# EAGLE design gateway (EAGLE 6.4)
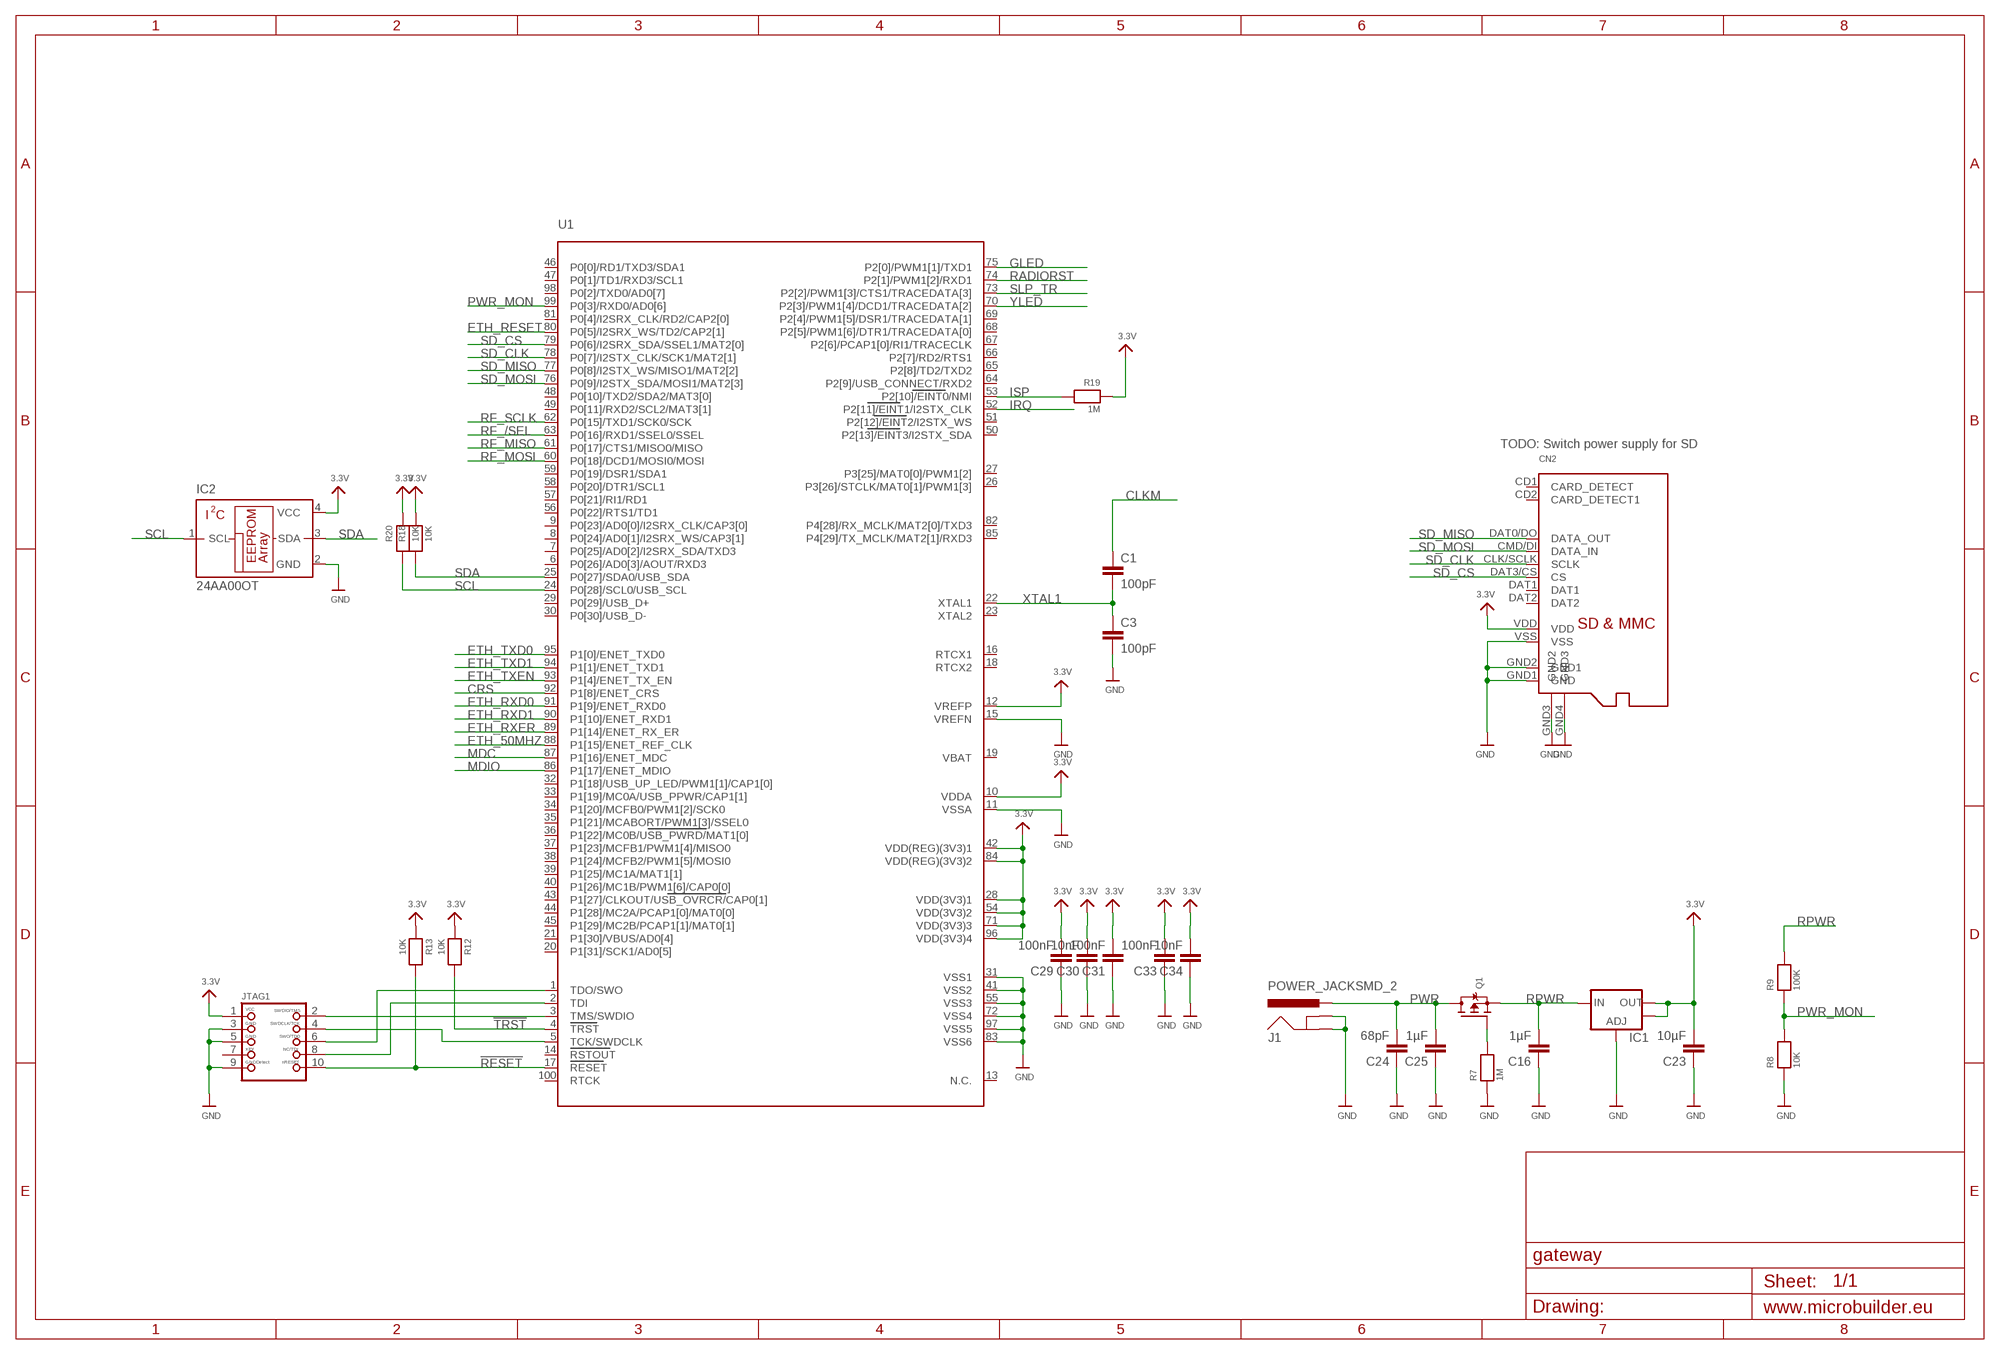
[diagram p0: schematic, sheet 1, part 1 of 2]
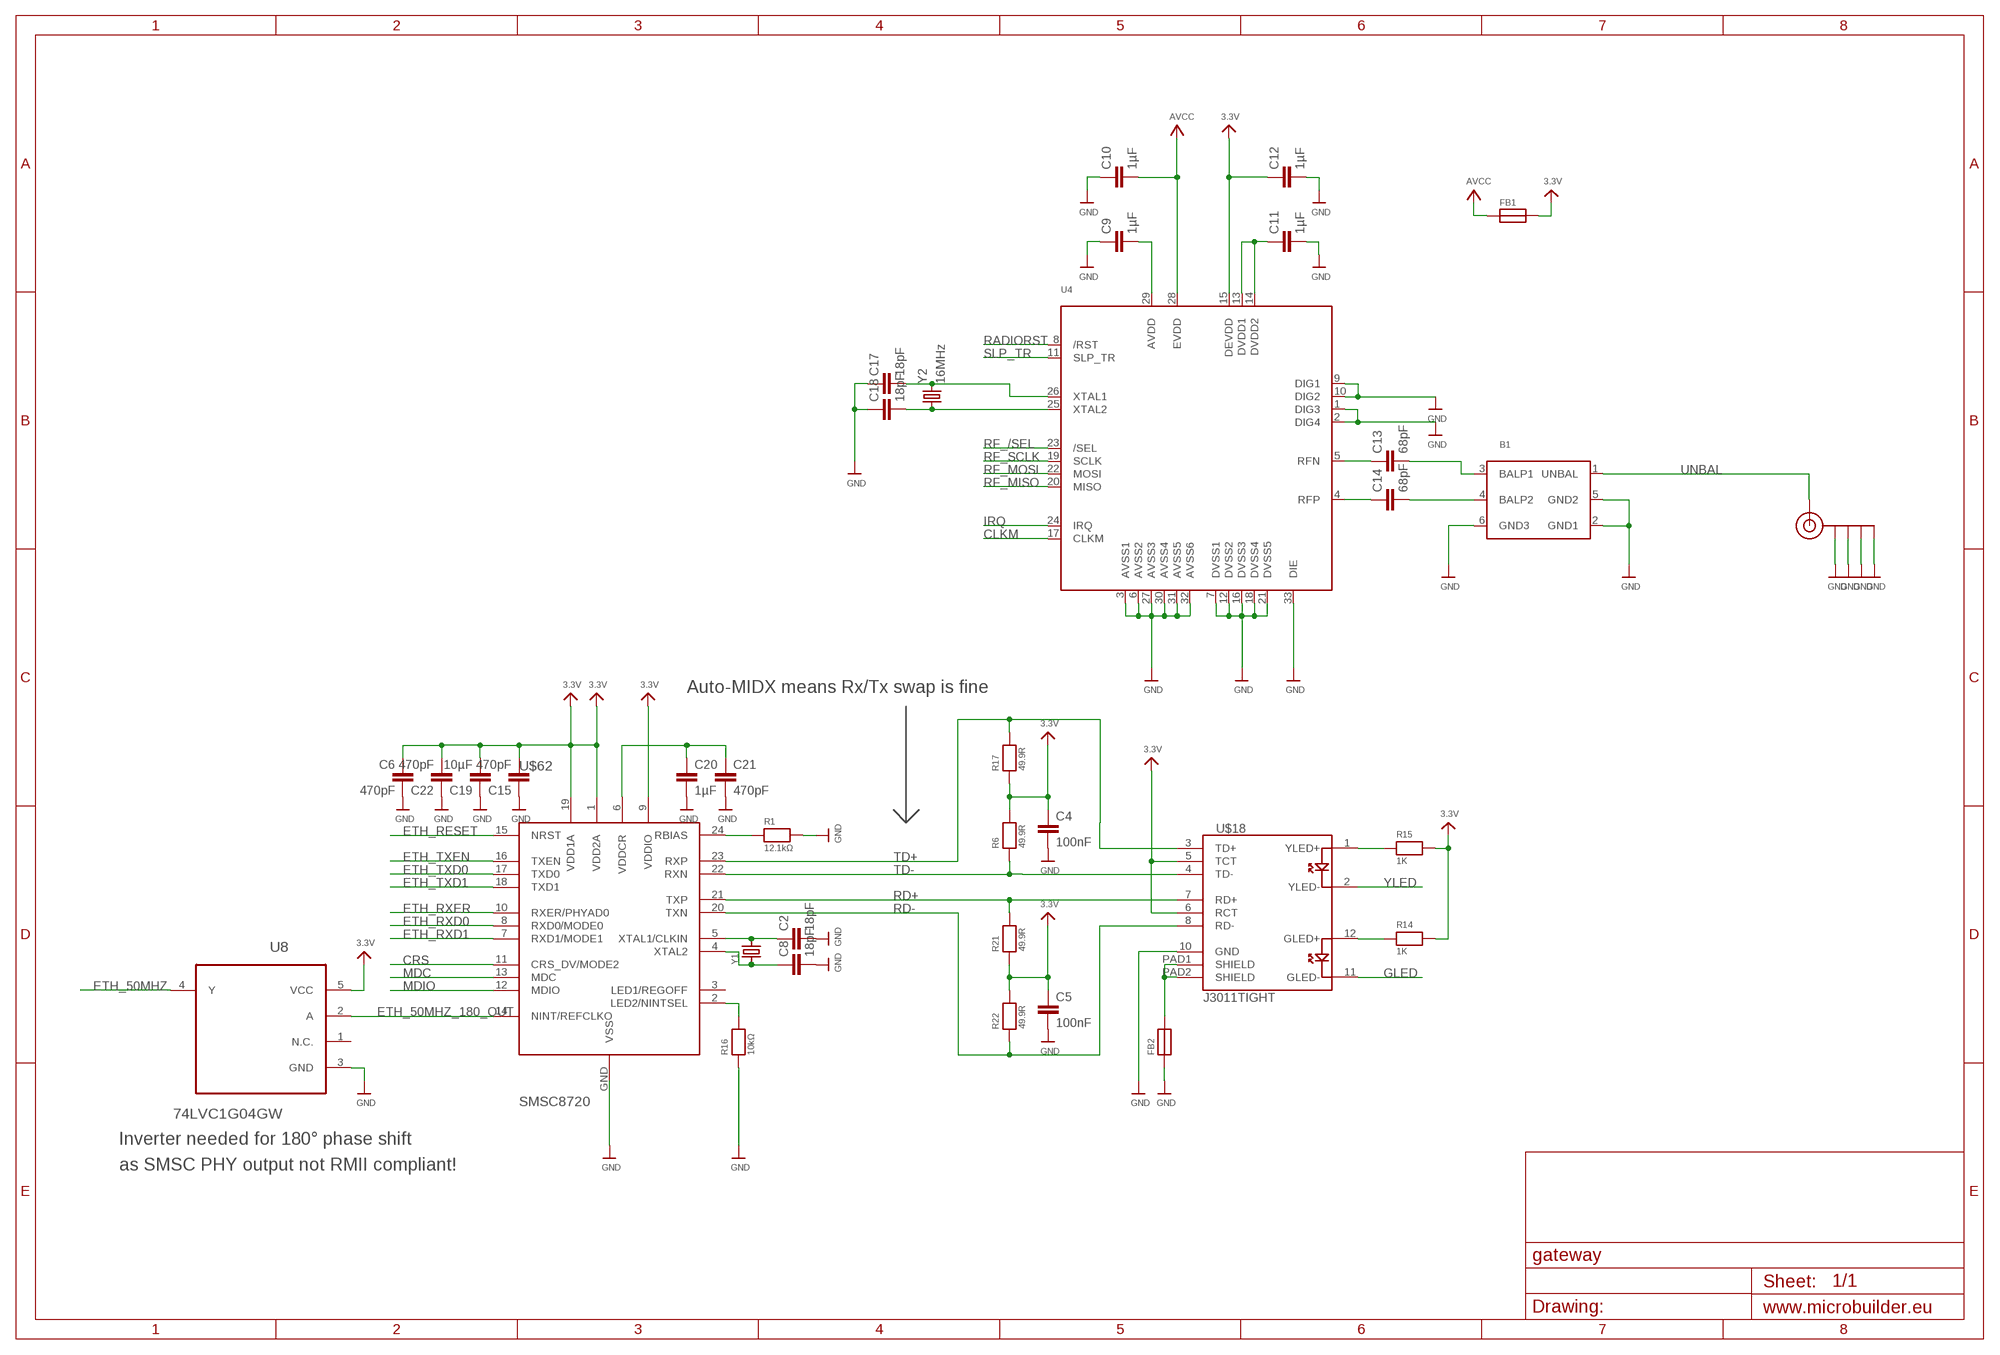
[diagram p1: schematic, sheet 1, part 2 of 2]

## Parts
B1  BALUN+LP  [BALUN0805]
C1  100pF  C-EUC0603K  [C0603K]
C2  18pF  C-EUC0603K  [C0603K]
C3  100pF  C-EUC0603K  [C0603K]
C4  100nF  C-EUC1206  [C1206]
C5  100nF  C-EUC1206  [C1206]
C6  470pF  C-EUC0603K  [C0603K]
C8  18pF  C-EUC0603K  [C0603K]
C9  1µF  C-EUC0603K  [C0603K]
C10  1µF  C-EUC0603K  [C0603K]
C11  1µF  C-EUC0603K  [C0603K]
C12  1µF  C-EUC0603K  [C0603K]
C13  68pF  C-EUC0603K  [C0603K]
C14  68pF  C-EUC0603K  [C0603K]
C15  470pF  C-EUC0603K  [C0603K]
C16  1µF  C-EUC0603K  [C0603K]
C17  18pF  C-EUC0603K  [C0603K]
C18  18pF  C-EUC0603K  [C0603K]
C19  10µF  C-EUC0603K  [C0603K]
C20  1µF  C-EUC0603K  [C0603K]
C21  470pF  C-EUC0603K  [C0603K]
C22  470pF  C-EUC0603K  [C0603K]
C23  10µF  C-EUC0603K  [C0603K]
C24  68pF  C-EUC0603K  [C0603K]
C25  1µF  C-EUC0603K  [C0603K]
C29  100nF  C-EUC0603K  [C0603K]
C30  10nF  C-EUC0603K  [C0603K]
C31  100nF  C-EUC0603K  [C0603K]
C33  100nF  C-EUC0603K  [C0603K]
C34  10nF  C-EUC0603K  [C0603K]
CN2  MICROSDDM3B  [MICROSD_DM3B]
FB1  FERRITE  [0603]
FB2  FERRITE  [0603]
IC1  V_REG_LM1117SOT223  [SOT223]
IC2  24AA00OT  [SOT23-5L]
J1  POWER_JACKSMD_2  [POWER_JACK_SMD_2]
J$1  SMA_EDGE  [SMA-EDGE]
JTAG1  JTAG-CORTEXM3  [2X05_1.27MM_SMT]
Q1  MOSFET-P  [SOT23-R]
R1  12.1kΩ  RESISTOR0603MINI  [0603-MINI]
R6  49.9R  RESISTOR0603MINI  [0603-MINI]
R7  1M  RESISTOR0603MINI  [0603-MINI]
R8  10K  RESISTOR0603MINI  [0603-MINI]
R9  100K  RESISTOR0603MINI  [0603-MINI]
R12  10K  RESISTOR0603MINI  [0603-MINI]
R13  10K  RESISTOR0603MINI  [0603-MINI]
R14  1K  RESISTOR0603MINI  [0603-MINI]
R15  1K  RESISTOR0603MINI  [0603-MINI]
R16  10kΩ  RESISTOR0603MINI  [0603-MINI]
R17  49.9R  RESISTOR0603MINI  [0603-MINI]
R18  10K  RESISTOR0603MINI  [0603-MINI]
R19  1M  RESISTOR0603MINI  [0603-MINI]
R20  10K  RESISTOR0603MINI  [0603-MINI]
R21  49.9R  RESISTOR0603MINI  [0603-MINI]
R22  49.9R  RESISTOR0603MINI  [0603-MINI]
U1  LPC1768  [LQFP100]
U4  AT86RF212  [32QN2]
U8  74LVC1G04GW  [SOT65P210X110-5N]
U$18  J3011TIGHT  [J3011_TIGHT]
U$62  SMSC8720  [QFN24_SMSC8720]
Y1  CRYSTALTHIN32K  [CRYSTAL_4.9X1.8]
Y2  16MHz  CRYSTAL5X3  [CRYSTAL-SMD-5X3]

## Nets
3.3V: C4.1 C5.1 C6.1 C12.1 C15.2 C19.2 C22.2 C23.2 C29.2 C30.2 C31.2 C33.2 C34.2 CN2.VDD FB1.2 IC1.2(OUT) IC1.4(OUT) IC2.4(VCC) JTAG1.1 R6.2 R12.1 R13.1 R14.2 R15.2 R17.1 R18.1 R19.1 R20.1 R21.1 R22.2 U1.10(VDDA) U1.12(VREFP) U1.28(VDD(3V3)1) U1.42(VDD(REG)(3V3)1) U1.54(VDD(3V3)2) U1.71(VDD(3V3)3) U1.84(VDD(REG)(3V3)2) U1.96(VDD(3V3)4) U4.15(DEVDD) U8.5(VCC) U$18.5(TCT) U$18.6(RCT) U$62.1(VDD2A) U$62.9(VDDIO) U$62.19(VDD1A)
!RESET!: JTAG1.10 R13.2 U1.17(RESET)
!TRST!: R12.2 U1.4(TRST)
AVCC: C10.2 FB1.1 U4.28(EVDD)
AVDD-IN: C9.2 U4.29(AVDD)
BALP1: B1.3(BALP1) C13.2
BALP2: B1.4(BALP2) C14.2
CGND: FB2.2 U$18.PAD1(SHIELD) U$18.PAD2(SHIELD)
CLKM: C1.1 U4.17(CLKM)
CRS: U1.92(P1[8]/ENET_CRS) U$62.11(CRS_DV/MODE2)
ETH_50MHZ: U1.88(P1[15]/ENET_REF_CLK) U8.4(Y)
ETH_50MHZ_180_OUT: U8.2(A) U$62.14(NINT/REFCLKO)
ETH_RESET: U1.80(P0[5]/I2SRX_WS/TD2/CAP2[1]) U$62.15(NRST)
ETH_RXD0: U1.91(P1[9]/ENET_RXD0) U$62.8(RXD0/MODE0)
ETH_RXD1: U1.90(P1[10]/ENET_RXD1) U$62.7(RXD1/MODE1)
ETH_RXER: U1.89(P1[14]/ENET_RX_ER) U$62.10(RXER/PHYAD0)
ETH_TXD0: U1.95(P1[0]/ENET_TXD0) U$62.17(TXD0)
ETH_TXD1: U1.94(P1[1]/ENET_TXD1) U$62.18(TXD1)
ETH_TXEN: U1.93(P1[4]/ENET_TX_EN) U$62.16(TXEN)
GLED: U1.75(P2[0]/PWM1[1]/TXD1) U$18.11(GLED-)
GLED+: R14.1 U$18.12(GLED+)
GND: B1.2(GND1) B1.5(GND2) B1.6(GND3) C2.2 C3.2 C4.2 C5.2 C6.2 C8.2 C9.1 C10.1 C11.2 C12.2 C15.1 C16.1 C17.1 C18.1 C19.1 C20.2 C21.2 C22.1 C23.1 C24.1 C25.1 C29.1 C30.1 C31.1 C33.1 C34.1 CN2.GND1(GND) CN2.GND2(GND1) CN2.GND3(GND2) CN2.GND4(GND3) CN2.VSS FB2.1 IC1.1(ADJ) IC2.2(GND) J1.GND(GNDBREAK) J1.P$4(GND) J$1.GND@0(GND) J$1.GND@1(GND) J$1.GND@2(GND) J$1.GND@3(GND) JTAG1.3 JTAG1.5 JTAG1.9 R1.2 R7.1 R8.1 R16.1 U1.11(VSSA) U1.15(VREFN) U1.31(VSS1) U1.41(VSS2) U1.55(VSS3) U1.72(VSS4) U1.83(VSS6) U1.97(VSS5) U4.1(DIG3) U4.2(DIG4) U4.3(AVSS1) U4.6(AVSS2) U4.7(DVSS1) U4.9(DIG1) U4.10(DIG2) U4.12(DVSS2) U4.16(DVSS3) U4.18(DVSS4) U4.21(DVSS5) U4.27(AVSS3) U4.30(AVSS4) U4.31(AVSS5) U4.32(AVSS6) U4.33(DIE) U8.3(GND) U$18.10(GND) U$62.GND(VSS)
IRQ: U1.52(P2[11]/EINT1/I2STX_CLK) U4.24(IRQ)
ISP: R19.2 U1.53(P2[10]/EINT0/NMI)
MDC: U1.87(P1[16]/ENET_MDC) U$62.13(MDC)
MDIO: U1.86(P1[17]/ENET_MDIO) U$62.12(MDIO)
N$5: C11.1 U4.13(DVDD1) U4.14(DVDD2)
N$20: R16.2 U$62.2(LED2/NINTSEL)
N$21: C2.1 U$62.5(XTAL1/CLKIN) Y1.2
N$22: C8.1 U$62.4(XTAL2) Y1.1
PWR: C24.2 C25.2 J1.VIN0(PWR) Q1.3(D)
PWR_MON: R8.2 R9.1 U1.99(P0[3]/RXD0/AD0[6])
Q1DOWN: Q1.1(G) R7.2
RADIORST: U1.74(P2[1]/PWM1[2]/RXD1) U4.8(/RST)
RBIAS: R1.1 U$62.24(RBIAS)
RD+: R21.2 U$18.7(RD+) U$62.21(TXP)
RD-: R22.1 U$18.8(RD-) U$62.20(TXN)
RF_/SEL: U1.63(P0[16]/RXD1/SSEL0/SSEL) U4.23(/SEL)
RF_MISO: U1.61(P0[17]/CTS1/MISO0/MISO) U4.20(MISO)
RF_MOSI: U1.60(P0[18]/DCD1/MOSI0/MOSI) U4.22(MOSI)
RF_SCLK: U1.62(P0[15]/TXD1/SCK0/SCK) U4.19(SCLK)
RF_XTAL1: C17.2 U4.26(XTAL1) Y2.3
RF_XTAL2: C18.2 U4.25(XTAL2) Y2.1
RFN: C13.1 U4.5(RFN)
RFP: C14.1 U4.4(RFP)
RPWR: C16.2 IC1.3(IN) Q1.2(S) R9.2
SCL: IC2.1(SCL) R20.2 U1.24(P0[28]/SCL0/USB_SCL)
SD_CLK: CN2.CLK/SCLK(SCLK) U1.78(P0[7]/I2STX_CLK/SCK1/MAT2[1])
SD_CS: CN2.DAT3/CS(CS) U1.79(P0[6]/I2SRX_SDA/SSEL1/MAT2[0])
SD_MISO: CN2.DAT0/DO(DATA_OUT) U1.77(P0[8]/I2STX_WS/MISO1/MAT2[2])
SD_MOSI: CN2.CMD/DI(DATA_IN) U1.76(P0[9]/I2STX_SDA/MOSI1/MAT2[3])
SDA: IC2.3(SDA) R18.2 U1.25(P0[27]/SDA0/USB_SDA)
SLP_TR: U1.73(P2[2]/PWM1[3]/CTS1/TRACEDATA[3]) U4.11(SLP_TR)
TCK_SWDCLK: JTAG1.4 U1.5(TCK/SWDCLK)
TD+: R17.2 U$18.3(TD+) U$62.23(RXP)
TD-: R6.1 U$18.4(TD-) U$62.22(RXN)
TDI: JTAG1.8 U1.2(TDI)
TDO_SWO: JTAG1.6 U1.1(TDO/SWO)
TMS_SWDIO: JTAG1.2 U1.3(TMS/SWDIO)
UNBAL: B1.1(UNBAL) J$1.SIG(SIGNAL)
VDDCR: C20.1 C21.1 U$62.6(VDDCR)
XTAL1: C1.2 C3.1 U1.22(XTAL1)
YLED: U1.70(P2[3]/PWM1[4]/DCD1/TRACEDATA[2]) U$18.2(YLED-)
YLED+: R15.1 U$18.1(YLED+)
Unconnected: CN2.CD1(CARD_DETECT) CN2.CD2(CARD_DETECT1) CN2.DAT1 CN2.DAT2 JTAG1.7 U1.6(P0[26]/AD0[3]/AOUT/RXD3) U1.7(P0[25]/AD0[2]/I2SRX_SDA/TXD3) U1.8(P0[24]/AD0[1]/I2SRX_WS/CAP3[1]) U1.9(P0[23]/AD0[0]/I2SRX_CLK/CAP3[0]) U1.13(N.C.) U1.14(RSTOUT) U1.16(RTCX1) U1.18(RTCX2) U1.20(P1[31]/SCK1/AD0[5]) U1.21(P1[30]/VBUS/AD0[4]) U1.23(XTAL2) U1.26(P3[26]/STCLK/MAT0[1]/PWM1[3]) U1.27(P3[25]/MAT0[0]/PWM1[2]) U1.29(P0[29]/USB_D+) U1.30(P0[30]/USB_D-) U1.32(P1[18]/USB_UP_LED/PWM1[1]/CAP1[0]) U1.33(P1[19]/MC0A/USB_PPWR/CAP1[1]) U1.34(P1[20]/MCFB0/PWM1[2]/SCK0) U1.35(P1[21]/MCABORT/PWM1[3]/SSEL0) U1.36(P1[22]/MC0B/USB_PWRD/MAT1[0]) U1.37(P1[23]/MCFB1/PWM1[4]/MISO0) U1.38(P1[24]/MCFB2/PWM1[5]/MOSI0) U1.39(P1[25]/MC1A/MAT1[1]) U1.40(P1[26]/MC1B/PWM1[6]/CAP0[0]) U1.43(P1[27]/CLKOUT/USB_OVRCR/CAP0[1]) U1.44(P1[28]/MC2A/PCAP1[0]/MAT0[0]) U1.45(P1[29]/MC2B/PCAP1[1]/MAT0[1]) U1.46(P0[0]/RD1/TXD3/SDA1) U1.47(P0[1]/TD1/RXD3/SCL1) U1.48(P0[10]/TXD2/SDA2/MAT3[0]) U1.49(P0[11]/RXD2/SCL2/MAT3[1]) U1.50(P2[13]/EINT3/I2STX_SDA) U1.51(P2[12]/EINT2/I2STX_WS) U1.56(P0[22]/RTS1/TD1) U1.57(P0[21]/RI1/RD1) U1.58(P0[20]/DTR1/SCL1) U1.59(P0[19]/DSR1/SDA1) U1.64(P2[9]/USB_CONNECT/RXD2) U1.65(P2[8]/TD2/TXD2) U1.66(P2[7]/RD2/RTS1) U1.67(P2[6]/PCAP1[0]/RI1/TRACECLK) U1.68(P2[5]/PWM1[6]/DTR1/TRACEDATA[0]) U1.69(P2[4]/PWM1[5]/DSR1/TRACEDATA[1]) U1.81(P0[4]/I2SRX_CLK/RD2/CAP2[0]) U1.82(P4[28]/RX_MCLK/MAT2[0]/TXD3) U1.85(P4[29]/TX_MCLK/MAT2[1]/RXD3) U1.98(P0[2]/TXD0/AD0[7]) U1.100(RTCK) U8.1(N.C.) U$62.3(LED1/REGOFF)

## Notes on the sheet
- TODO: Switch power supply for SD
- Auto-MIDX means Rx/Tx swap is fine
- Inverter needed for 180° phase shift
- as SMSC PHY output not RMII compliant!

## Power pins joined to a net without a drawn wire
VBAT: U1.19(VBAT)

## Library data of the parts
B1 = microbuilder:BALUN+LP: Balun + Low Pass Filter 0805 863-928 MHz Balun + Low Pass Filter (0805) - Digikey: 712-1473-1-ND
C1-C6 C8-C25 C29-C31 C33 C34 = resistor:C-EU: CAPACITOR, European symbol
CN2 = microbuilder:MICROSD: MicroSD/Transflash Card Holder with SPI pinout 3M: 2908-05WB-M6 4UConnector: 19656 Footprint courtesy: Adafruit Industries
FB1 FB2 = microbuilder:FERRITE: Ferrite Bead 0603 MMZ1608B121C - 120 Ohm, 600mA Ferrite Chip - Digikey: 445-2164-1-ND BK1608HW121-T - 120 Ohm, 600mA Ferrite Chip - Digikey: 587-1876-2-ND
IC1 = SparkFun:V_REG_LM1117: Voltage Regulator LM1117 Standard adjustable voltage regulator but in SMD form. Spark Fun Electronics SKU : COM-00595
IC2 = microchip:24*00: Serial EEPROM 128 bit, I2C (AA = 1.8 V/LC = 2.5 V/C = 5.0 V); MF: MICROCHIP; MPN: 24AA00T-I/OTG; OC_FARNELL: 1331264; OC_NEWARK: 89H3038
J1 = SparkFun:POWER_JACK: Power Jack This is the standard 5.5mm barrel jack for power. The PTH is the most common, proven, reliable, footprint. All others are experimental. The Slot footprint only works if the mill layer is transmitted to the PCB fab house so be warned. Spark Fun Electronics SKU : PRT-00119. Mating wall wart : TOL-00298 (and others)
J$1 = SparkFun-Connectors:SMA_EDGE: SMA Antenna Connector End launch SMA connector. The paste layer has been removed so that the connector can be hand soldered onto the board after reflow.
JTAG1 = microbuilder_v3:JTAG-CORTEXM3: Serial Wire (SW-DP) Connector This standard 0.05" 10-pin connector is for use with the Cortex M0/M3's native SWD (serial wire debugger) interface (SW-DP). Some boards support a 20-pin combined JTAG+SWD connector (SWJ-DP), such as the LPC1700 family, but many smaller devices only work with SWD which typically use the smaller 10-pin SW-DP connecter (the LPC1300 family, for example, only supports SWD). 2x05 1.27mm/0.05" Connector: This is the standard SMT connector defined by ARM for all Cortex devices, and should be used in most situations and for forward-compatibility since any new devices coming to market will likely use this connector. MOLEX 10 Pin 0.1" Connector: This 0.1" 10 pin connector has the same pin layout as the standard 0.05" connector, but is easier to work with if you are using standard jumper wires or custom cables to connect your SWD hardware. MOLEX 20 Pin 0.1" Connector: This 0.1" 20 pin connector is the same model used for ARM7/ARM9 JTAG debuggers, but is connected to match the pins on the Segger J-Link for ARM (which supports both JTAG and SWD debugging). See the following document from ARM for more information on Cortex M3 Debug Connectors: http://infocenter.arm.com/help/topic/com.arm.doc.faqs/attached/13634/cortex_debug_connectors.pdf And the following page for an overview with images of the different connector types: http://www.keil.com/peripherals/coresight/connectors.asp
Q1 = microbuilder:MOSFET-P: P-Channel Mosfet SOT-23 IRLML5103 30V 760mA 1V Vgs - Digikey: IRLML5103PBFCT-ND NTR0202PL 20V 400mA 2.3V Vgs - Digikey: NTR0202PLT1GOSTR-ND NTR4101PT1G 20V 1.8A 1.2V Vgs - Digikey: NTR4101PT1GOSCT-ND DMP2004K 20V 600mA 1V Vgs - Digikey: DMP2004KDICT-ND
R1 R6-R9 R12-R22 = microbuilder:RESISTOR: Resistors 0402 - 0402 Surface Mount Package 22 Ohm 1% 1/16W [Digikey: 311-22.0LRTR-ND] 33 Ohm 5% 1/16W 1.0K 5% 1/16W 1.5K 5% 1/16W 2.0K 1% 1/16W 10.0K 1% 1/16W [Digikey: 311-10.0KLRTR-ND] 10.0K 5% 1/16W [Digikey: RMCF0402JT10K0TR-ND] 12.1K 1% 1/16W [Digikey: 311-22.0LRTR-ND] 100.0K 5% 1/16W 0603 - 0603 Surface Mount Package 0 Ohm 1/10 Watt 1% Resistor 15 Ohm 1/10 Watt 1% Resistor 33 Ohm 1/10 Watt 1% Resistor 49.9 Ohm 1/10 Watt 1% Resistor 100 Ohm 1/10 Watt 1% Resistor 150 Ohm 1/10 Watt 1% Resistor 240 Ohm 1/10 Watt 1% Resistor 390 Ohm 1/10 Watt 1% Resistor 560 Ohm 1/10 Watt 1% Resistor 680 Ohm 1/10 Watt 1% Resistor 750 Ohm 1/10 Watt 1% Resistor 1.0K Ohm 1/10 Watt 1% Resistor 1.5K Ohm 1/10 Watt 1% Resistor 2.0K Ohm 1/10 Watt 1% Resistor 2.2K Ohm 1/10 Watt 1% Resistor 3.3K Ohm 1/10 Watt 1% Resistor 4.7K Ohm 1/10 Watt 1% Resistor 10.0K Ohm 1/10 Watt 1% Resistor 12.0K Ohm 1/10 Watt 1% Resistor 12.1K Ohm 1/10 Watt 1% Resistor 20.0K Ohm 1/10 Watt 1% Resistor 33.0K Ohm 1/10 Watt 1% Resistor 100.0K Ohm 1/10 Watt 1% Resistor 0805 - 0805 Surface Mount Package 0 Ohm 1/8 Watt 1% Resistor 33 Ohm 1/8 Watt 1% Resistor 100 Ohm 1/8 Watt 1% Resistor 150 Ohm 1/8 Watt 1% Resistor 200 Ohm 1/8 Watt 1% Resistor 240 Ohm 1/8 Watt 1% Resistor 330 Ohm 1/8 Watt 1% Resistor 390 Ohm 1/8 Watt 1% Resistor 470 Ohm 1/8 Watt 1% Resistor 1.0K Ohm 1/8 Watt 1% Resistor 1.5K Ohm 1/8 Watt 1% Resistor 2.0K Ohm 1/8 Watt 1% Resistor 4.7K Ohm 1/8 Watt 1% Resistor 5.1K Ohm 1/8 Watt 1% Resistor 5.6K Ohm 1/8 Watt 1% Resistor 10.0K Ohm 1/8 Watt 1% Resistor 22.0K Ohm 1/8 Watt 1% Resistor 33.0K Ohm 1/8 Watt 1% Resistor 100K Ohm 1/8 Watt 1% Resistor 1206 - 1206 Surface Mount Package 2012 - 2010 Surface Mount Package 0.11 Ohm 1/2 Watt 1% Resistor - Digikey: RHM.11UCT-ND
U1 = microbuilder:LPC1768: LPC1768 100 MHz 32-bit ARM Cortex-M3 based microcontroller featuring a high level of integration and low power consumption. 512 kB Flash, 64 kB SRAM, USB Device/Host/OTG, Ethernet, CAN, I2S, 10-bit DAC Digikey: 568-4796-ND
U4 = microbuilder:AT86RF212: AT86RF212 - Low-Power SPI-based 700/800/900 MHz Transceiver Digikey: AT86RF212-ZU-ND
U8 = 74LVC1G04GW_inverter:74LVC1G04GW: Single inverter; MPN: 74LVC1G04GW; OC_FARNELL: 1631683; OC_NEWARK: 03P2774; PACKAGE: SOT-5; SUPPLIER: NXP
U$18 = J3011:J3011
U$62 = SMSC8720:SMSC8720
Y1 = microbuilder:CRYSTAL: Crystals
Y2 = SparkFun:CRYSTAL: Crystals

## Board
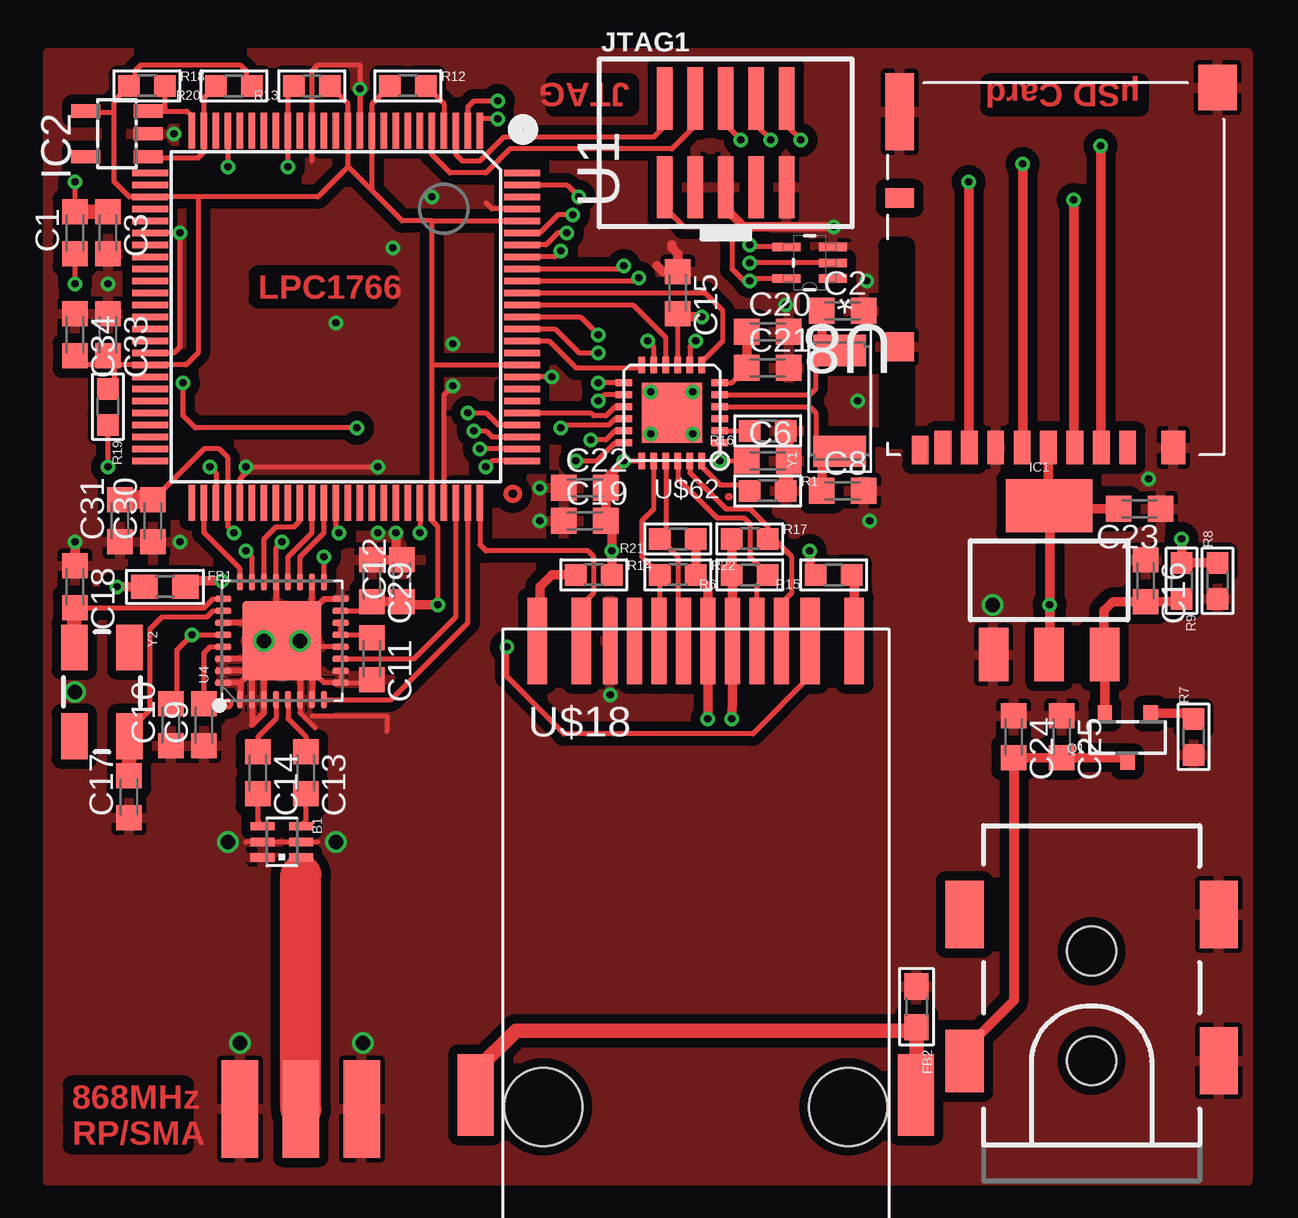
[diagram p2: board, top side]
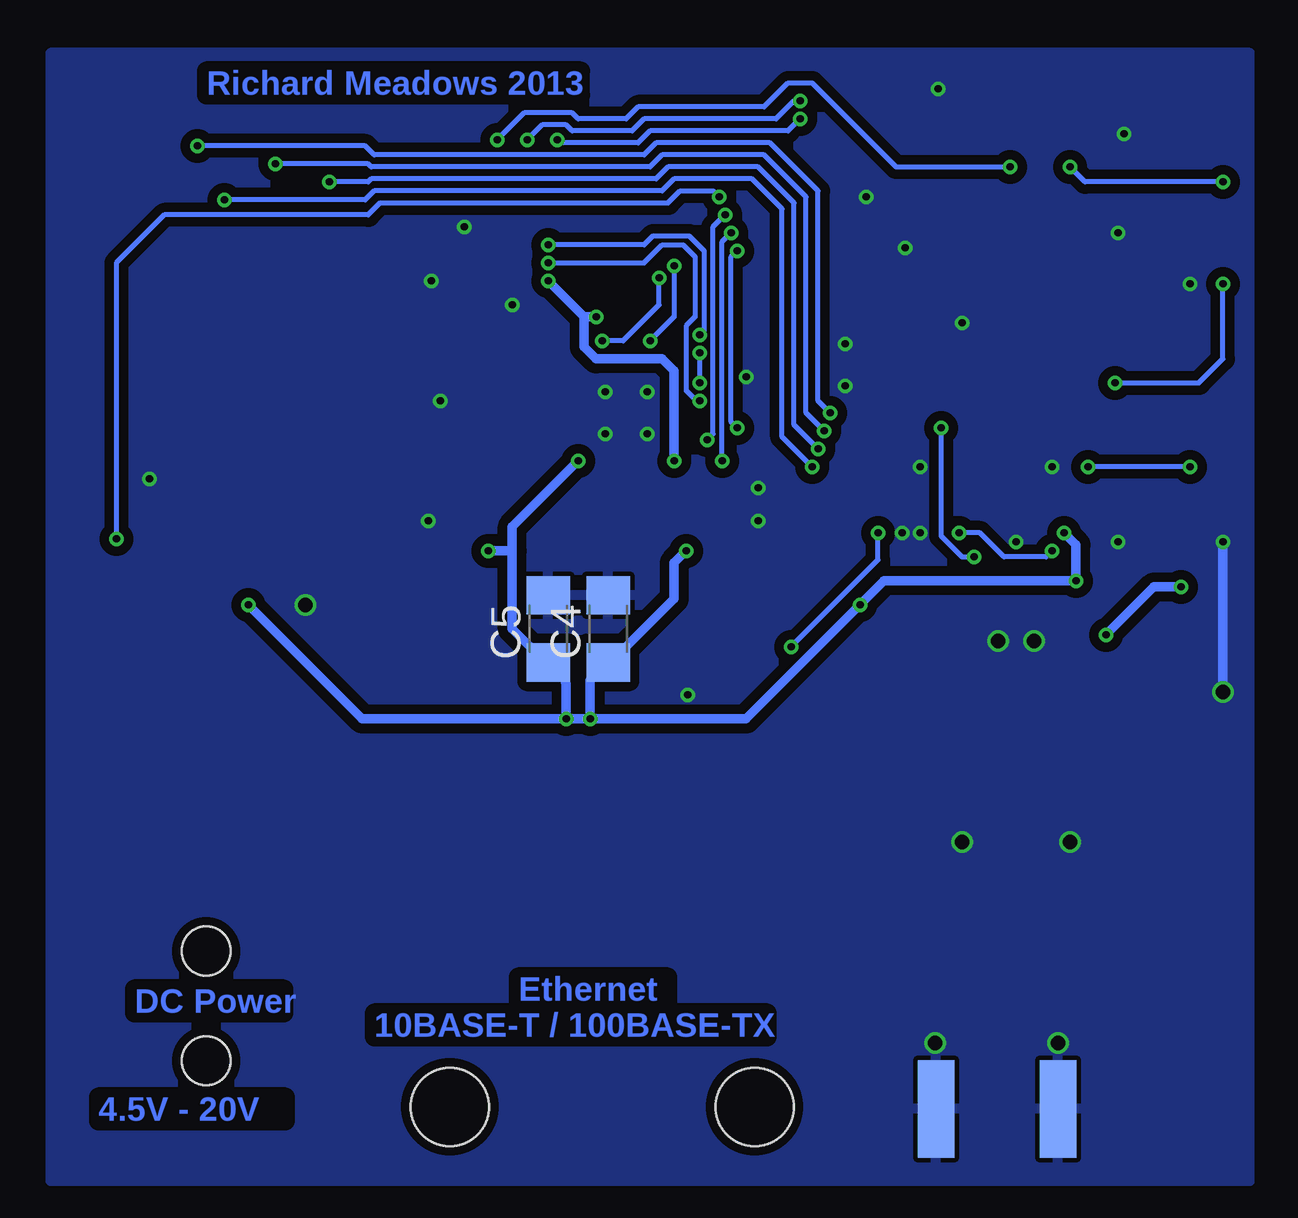
[diagram p3: board, bottom side, seen from below]

No outline drawn. Coordinates in mm, seen from the top.
Copper layers (1*16): Top 0.035mm / dielectric 1.5mm / Bottom 0.035mm
Design rules "default": minimum track width 0.15mm, minimum drill 0.3mm, track to track 0.15mm, track to pad 0.15mm, pad to pad 0.15mm, via to via 0.15mm, smd to smd 0.15mm, copper to edge 0.3mm, drill to drill 0.2mm, minimum pad ring 0.2mm, minimum via ring 0.15mm, stop-mask expansion 0.075mm, vias tented up to drill 0mil, thermal gap 0.2mm

### Footprints (pad centres in the part's own frame; a part is rotated, then mirrored left to right if it is on the bottom)
BALUN0805 = smd 0.35 x 1: 1 0.65,0.8; 2 0,0.8; 3 -0.65,0.8; 4 -0.65,-0.8; 5 0,-0.8; 6 0.65,-0.8
C0603K = smd 1.05 x 1.08: 1 -0.875,0; 2 0.875,0
C1206 = smd 1.6 x 1.8: 1 -1.4,0; 2 1.4,0
MICROSD_DM3B = smd 0.7 x 1.2: CD1 8.65,0.8 | smd 1.2 x 0.8: CD2 9.5,-9.7 | smd 0.7 x 1.4: CLK/SCLK 4.4,0.7; CMD/DI 2.2,0.7; DAT0/DO 6.6,0.7; DAT1 7.7,0.7; DAT2 0,0.7; DAT3/CS 1.1,0.7; VDD 3.3,0.7; VSS 5.5,0.7 | smd 1 x 1.4: GND1 -1.9,0.7 | smd 1.2 x 1.2: GND2 9.5,-3.5 | smd 1.2 x 3.2: GND3 9.5,-13.3 | smd 1.6 x 1.9: GND4 -3.75,-14.3
0603 = smd 1.1 x 1: 1 -0.85,0; 2 0.85,0
SOT223 = smd 1.219 x 2.235: 1 -2.311,-3.099; 2 0,-3.099; 3 2.311,-3.099 | smd 3.6 x 2.2: 4 0,3.099
SOT23-5L = smd 0.55 x 1.2: 1 -0.95,-1.3; 2 0,-1.3; 3 0.95,-1.3; 4 0.95,1.3; 5 -0.95,1.3
POWER_JACK_SMD_2 = smd 2.8 x 1.6: GND 0,-5.3; P$4 6.1,-5.3; VIN1 6.1,5.3 | smd 2.6 x 1.6: VIN0 0,5.3 | hole 2.032: 0,0; 4.572,0
SMA-EDGE = smd 1.524 x 4.064: GND@0 0,0; GND@1 5.08,0; SIG 2.54,0 | smd 1.524 x 4.064 bottom: GND@2 0,0; GND@3 5.08,0
2X05_1.27MM_SMT = smd 0.65 x 2.6: 1 -2.54,-1.85; 2 -2.54,1.85; 3 -1.27,-1.85; 4 -1.27,1.85; 5 0,-1.85; 6 0,1.85; 7 1.27,-1.85; 8 1.27,1.85; 9 2.54,-1.85; 10 2.54,1.85
SOT23-R = smd 0.6 x 0.7: 1 -0.95,-1; 2 0.95,-1; 3 0,1
0603-MINI = smd 0.9 x 0.9: 1 -0.75,0; 2 0.75,0
LQFP100 = smd 0.27 x 1.5: 1 -6,-7.75; 2 -5.5,-7.75; 3 -5,-7.75; 4 -4.5,-7.75; 5 -4,-7.75; 6 -3.5,-7.75; 7 -3,-7.75; 8 -2.5,-7.75; 9 -2,-7.75; 10 -1.5,-7.75; 11 -1,-7.75; 12 -0.5,-7.75; 13 0,-7.75; 14 0.5,-7.75; 15 1,-7.75; 16 1.5,-7.75; 17 2,-7.75; 18 2.5,-7.75; 19 3,-7.75; 20 3.5,-7.75; 21 4,-7.75; 22 4.5,-7.75; 23 5,-7.75; 24 5.5,-7.75; 25 6,-7.75; 51 6,7.75; 52 5.5,7.75; 53 5,7.75; 54 4.5,7.75; 55 4,7.75; 56 3.5,7.75; 57 3,7.75; 58 2.5,7.75; 59 2,7.75; 60 1.5,7.75; 61 1,7.75; 62 0.5,7.75; 63 0,7.75; 64 -0.5,7.75; 65 -1,7.75; 66 -1.5,7.75; 67 -2,7.75; 68 -2.5,7.75; 69 -3,7.75; 70 -3.5,7.75; 71 -4,7.75; 72 -4.5,7.75; 73 -5,7.75; 74 -5.5,7.75; 75 -6,7.75 | smd 1.5 x 0.27: 26 7.75,-6; 27 7.75,-5.5; 28 7.75,-5; 29 7.75,-4.5; 30 7.75,-4; 31 7.75,-3.5; 32 7.75,-3; 33 7.75,-2.5; 34 7.75,-2; 35 7.75,-1.5; 36 7.75,-1; 37 7.75,-0.5; 38 7.75,0; 39 7.75,0.5; 40 7.75,1; 41 7.75,1.5; 42 7.75,2; 43 7.75,2.5; 44 7.75,3; 45 7.75,3.5; 46 7.75,4; 47 7.75,4.5; 48 7.75,5; 49 7.75,5.5; 50 7.75,6; 76 -7.75,6; 77 -7.75,5.5; 78 -7.75,5; 79 -7.75,4.5; 80 -7.75,4; 81 -7.75,3.5; 82 -7.75,3; 83 -7.75,2.5; 84 -7.75,2; 85 -7.75,1.5; 86 -7.75,1; 87 -7.75,0.5; 88 -7.75,0; 89 -7.75,-0.5; 90 -7.75,-1; 91 -7.75,-1.5; 92 -7.75,-2; 93 -7.75,-2.5; 94 -7.75,-3; 95 -7.75,-3.5; 96 -7.75,-4; 97 -7.75,-4.5; 98 -7.75,-5; 99 -7.75,-5.5; 100 -7.75,-6
32QN2 = smd 0.7 x 0.25: 1 -2.45,1.75; 2 -2.45,1.25; 3 -2.45,0.75; 4 -2.45,0.25; 5 -2.45,-0.25; 6 -2.45,-0.75; 7 -2.45,-1.25; 8 -2.45,-1.75; 17 2.45,-1.75; 18 2.45,-1.25; 19 2.45,-0.75; 20 2.45,-0.25; 21 2.45,0.25; 22 2.45,0.75; 23 2.45,1.25; 24 2.45,1.75 | smd 0.25 x 0.7: 9 -1.75,-2.45; 10 -1.25,-2.45; 11 -0.75,-2.45; 12 -0.25,-2.45; 13 0.25,-2.45; 14 0.75,-2.45; 15 1.25,-2.45; 16 1.75,-2.45; 25 1.75,2.45; 26 1.25,2.45; 27 0.75,2.45; 28 0.25,2.45; 29 -0.25,2.45; 30 -0.75,2.45; 31 -1.25,2.45; 32 -1.75,2.45 | smd 3.3 x 3.3: 33 0,0
SOT65P210X110-5N = smd 1.168 x 0.356: 1 -0.965,0.66; 2 -0.965,0; 3 -0.965,-0.66; 4 0.965,-0.66; 5 0.965,0.66
J3011_TIGHT = smd 0.81 x 3.6: 1 6.61,-0.5; 2 4.77,-0.5; 11 -4.77,-0.5; 12 -6.61,-0.5 | smd 0.61 x 3.6: 3 3.57,-0.5; 4 2.55,-0.5; 5 1.53,-0.5; 6 0.51,-0.5; 7 -0.51,-0.5; 8 -1.53,-0.5; 9 -2.55,-0.5; 10 -3.57,-0.5 | smd 1.5 x 3.4: PAD1 9.17,-19.42; PAD2 -9.17,-19.42 | hole 3.25: -6.35,-19.92; 6.35,-19.92
QFN24_SMSC8720 = smd 0.69 x 0.28: 1 -2,1.25; 2 -2,0.75; 3 -2,0.25; 4 -2,-0.25; 5 -2,-0.75; 6 -2,-1.25; 13 2,-1.25; 14 2,-0.75; 15 2,-0.25; 16 2,0.25; 17 2,0.75; 18 2,1.25 | smd 0.28 x 0.69: 7 -1.25,-2; 8 -0.75,-2; 9 -0.25,-2; 10 0.25,-2; 11 0.75,-2; 12 1.25,-2; 19 1.25,2; 20 0.75,2; 21 0.25,2; 22 -0.25,2; 23 -0.75,2; 24 -1.25,2 | smd 2.5 x 2.5: GND 0,0
CRYSTAL_4.9X1.8 = smd 1.3 x 2.2: 1 -2.1,0; 2 2.1,0
CRYSTAL-SMD-5X3 = smd 1.9 x 1.1: 1 -1.85,-1.15; 2 1.85,-1.15; 3 1.85,1.15; 4 -1.85,1.15

### Placement (x,y rotation side)
B1  9.75,14.12 270 top
C1  1.12,39.5 90 top
C2  33.12,36.25 0 top
C3  2.5,39.5 270 top
C4  26.75,23 90 bottom
C5  29.25,23 90 bottom
C6  30,30 0 top
C8  33.12,28.75 0 top
C9  6.5,19 90 top
C10  5.12,19 90 top
C11  13.5,21.75 270 top
C12  14.75,25 90 top
C13  10.75,17 270 top
C14  8.75,17 270 top
C15  26.25,37 270 top
C16  45.75,25 270 top
C17  3.38,16 90 top
C18  1.12,24.75 270 top
C19  22.38,27.5 0 top
C20  30,35.38 0 top
C21  30,33.88 0 top
C22  22.38,28.88 0 top
C23  45.5,28 180 top
C24  40.25,18.5 270 top
C25  42.25,18.5 270 top
C29  13.5,25 270 top
C30  4.38,27.5 90 top
C31  3,27.5 90 top
C33  2.5,35.25 270 top
C34  1.12,35.25 270 top
CN2  45,31.25 180 top
FB1  4.88,24.75 0 top
FB2  36.2,7.25 270 top
IC1  41.73,25.02 0 top
IC2  2.88,43.62 90 top
J1  43.5,5 90 top
J$1  8,3 0 top
JTAG1  28.25,43.25 0 top
Q1  45,18.48 180 top
R1  30,28.75 0 top
R6  29.25,25.25 180 top
R7  47.75,18.5 90 top
R8  48.75,25 90 top
R9  47.25,25 270 top
R12  15,45.62 0 top
R13  11,45.62 180 top
R14  22.75,25.25 0 top
R15  32.75,25.25 180 top
R16  30,31.25 180 top
R17  29.25,26.75 0 top
R18  4.12,45.62 0 top
R19  2.5,32.25 270 top
R20  7.75,45.62 180 top
R21  26.25,26.75 180 top
R22  26.25,25.25 0 top
U1  12,36 180 top
U4  9.75,22.5 90 top
U8  31.75,38.25 180 top
U$18  27,23 0 top
U$62  26,32 180 top
Y1  33,32.5 90 top
Y2  2.25,20.38 270 top

### Tracks (layer width: path | path; a pad name or v marks a point on that pad's centre or on a via)
3.3V  (via drill 0.3)
  Top 0.2: 16,40 14.75,40 13.5,41.25 | 13.5,41.25 U1.10 13.5,44.88 R12.1 | 12.5,42.25 U1.12 12.5,44.88 R13.1 | 13.5,41.25 12.5,42.25 | 6.25,41 11.25,41 12.5,42.25 | 6.25,41 U1.28 3.38,41 2.75,41.62 2.75,44.5 | 16,34 U1.84 | 16,34 16,40 | v7.75,27 7.5,27.25 U1.54 7.5,30.12 7.12,30.5 6.5,30.5 4.25,28.25 4.38,28 C30.2 | v16.25,24 16.25,27.25 16,27.5 U1.71 16,34 | 16,40 U1.96 | 6.25,41 6.25,34.5 5.75,34 U1.42 2.88,34 | R20.1 8.25,45.88 8.25,46.25 8,46.5 3.88,46.5 3.62,46.25 3.62,46 3.38,45.75 R18.1 2.75,45 2.75,44.5 | IC2.4 1.65,44.5 2.75,44.5 | 2.88,34 C33.2 2.5,34.25 2.25,34 1.62,34 C34.2 | R19.1 2.75,33.25 2.75,33.88 2.88,34 | U$62.9 C15.2 | U$62.1 v28,30 C6.1 | v24,30 U$62.19 | U4.15 13.5,23.75 C29.2 | U8.5 29.34,37.59 v29.25,37.5 29,37.5 28.5,38 28.5,39.25 28,39.75 26.5,39.75 25.71,40.54 JTAG1.1
  Top 0.4: FB1.2 6,25 v7.25,25 | 41.75,30.55 CN2.VDD 41.7,28.15 IC1.4 41.85,28 | 26,36.38 C15.2 26.38,36 v27.25,36 | v24,30 23.25,29.25 C22.2 C19.2 23.5,27.25 v23.5,26.25 R14.2 | R17.1 R6.2 28.53,25.22 U$18.5 28.53,20.28 v28.5,19.25 | R21.1 R22.2 27.51,24.74 U$18.6 v27.5,19.25 | 31.75,25.5 v31.75,26.25 | C23.2 41.85,28 | IC1.2 41.75,21.95 v41.75,24 41.75,27.9 41.85,28 | C29.2 C12.1 | 14.88,24.25 15.12,24 v16.25,24
  Top 0.406: R15.2 31.75,25.5
  Top 0.6: C12.1 14.88,24.25
  Top 0.8: C30.2 C31.2
  Bottom 0.4: v7.75,27 7.25,26.5 v7.25,25 15.25,25 v16.25,24 21,19.25 v27.5,19.25 | v24,30 24,33.75 24.5,34.25 27.25,34.25 27.75,34.75 27.75,36 | v29.25,37.5 27.75,36 | v28.5,19.25 28.5,20.72 28.53,20.75 28.53,20.88 C5.1 29.35,21.6 30.75,23 30.75,26.25 | v27.5,19.25 27.5,20.85 C4.1 26.35,22 26.25,22 24,24.25 24,25.75 v23.5,26.25 | 30.75,26.25 30.75,27.25 v28,30 | v31.75,26.25 30.75,26.25 | v41.75,24 37,19.25 v28.5,19.25 | v27.25,36 27.75,36 | v27.5,19.25 v28.5,19.25
!RESET!  (via drill 0.3)
  Top 0.2: R13.2 10,45.25 U1.17 v10,42.25 | 30.75,45.06 JTAG1.10 30.79,43.96 v31.38,43.38
  Bottom 0.2: v31.38,43.38 30.25,44.5 28.25,44.5 28,44.25 26,44.25 25.5,44.75 20.25,44.75 19.25,45.75 18.25,45.75 14.75,42.25 v10,42.25
!TRST!
  Top 0.2: U1.4 16.5,44.88 R12.2
AVCC  (via drill 0.3)
  Top 0.2: U4.28 v6,22.75 5.38,22.12 5.38,20.25 5.12,20 C10.2
  Top 0.4: v2.88,24.75 FB1.1
  Bottom 0.4: v6,22.75 4,24.75 v2.88,24.75
AVDD-IN
  Top 0.2: U4.29 6.75,22.25 6.5,22 C9.2
BALP1
  Top 0.2: B1.3 10.75,15 C13.2
BALP2
  Top 0.2: B1.4 8.75,15 C14.2
CGND
  Top 0.6: U$18.PAD1 36.2,3.61 FB2.2 36.05,6.25 19.5,6.25 17.83,4.58 U$18.PAD2
CLKM  (via drill 0.3)
  Top 0.2: U4.17 v11.5,26 | v1.12,37.38 C1.1 | v5.62,33.25 5.62,31.88 6.12,31.38 v12.88,31.38
  Bottom 0.2: v1.12,37.38 1.12,34.25 2.12,33.25 v5.62,33.25 | v12.88,31.38 12.88,26.88 12,26 v11.5,26
CRS  (via drill 0.3)
  Top 0.2: U1.92 23.88,38 v24,38.12 | U$62.11 25.25,34.75 v25,35
  Bottom 0.2: v24,38.12 24,36 v25,35
ETH_50MHZ  (via drill 0.3)
  Top 0.2: U1.88 22.19,36 v22.94,35.25 | U8.4 29.34,38.91 v29.25,39
  Bottom 0.2: v22.94,35.25 22.75,35.44 22.75,38.75 23.38,39.38 24.88,39.38 25.25,39 v29.25,39
ETH_50MHZ_180_OUT  (via drill 0.3)
  Top 0.2: U$62.14 23.19,32.75 v22.94,32.5 | U8.2 v29.25,38.25
  Bottom 0.2: v29.25,38.25 25.25,38.25 24.5,39 23.62,39 23.12,38.5 23.12,36 23.5,35.62 23.5,32.94 23.06,32.5 v22.94,32.5
ETH_RESET
  Top 0.2: U$62.15 23.62,32.25 23.25,31.88 22.75,31.88 22.62,32 U1.80
ETH_RXD0  (via drill 0.3)
  Top 0.2: U1.91 24.5,37.5 v24.62,37.62 | v27,35 26.75,34.75 U$62.8
  Bottom 0.2: v27,35 26.12,35 24.62,36.5 v24.62,37.62
ETH_RXD1
  Top 0.2: U1.90 27.38,37 28.12,36.25 28.12,35 27.25,34.12 U$62.7
ETH_RXER
  Top 0.2: U1.89 24.38,36.5 25.75,35.12 U$62.10
ETH_TXD0  (via drill 0.3)
  Top 0.2: U1.95 20.5,39.5 21.25,40.25 v21.88,40.25 | U$62.17 23.62,31.25 23.25,30.88 v22.62,30.88
  Bottom 0.2: v22.62,30.88 22.38,31.12 22.38,39.75 v21.88,40.25
ETH_TXD1  (via drill 0.3)
  Top 0.2: U1.94 20.75,39 21.25,39.5 v21.62,39.5 | v22,30 22.88,30 23.62,30.75 U$62.18
  Bottom 0.2: v21.62,39.5 22,39.12 v22,30
ETH_TXEN  (via drill 0.3)
  Top 0.2: U1.93 21.12,38.5 v21.38,38.75 | v21.38,31.38 21.5,31.5 23.38,31.5 23.62,31.75 U$62.16
  Bottom 0.2: v21.38,31.38 21.62,31.62 21.62,38.5 v21.38,38.75
GLED
  Top 0.2: U$18.11 22.23,23.98 22.75,24.5 22.75,26 22.5,26.25 18.25,26.25 18,26.5 U1.75
GLED+
  Top 0.4: R14.1 21,25.25 20.5,24.75 20.5,22.61
  Top 0.406: 20.5,22.61 U$18.12
GND  (via drill 0.3, 0.6)
  Top 0.2: v9.75,26.62 9.5,26.38 9.5,25 U4.21 | 11,19.38 14.12,19.38 14.12,18.73 | U1.72 16.5,32.75 v16.88,33.12 | v21,33.5 U1.83 | 11,42.5 U1.15 11,46.25 11.25,46.5 13,46.5 U1.11 v13,45.5 | U1.97 18.5,40.5 18.25,40.75 | U1.41 5.25,34.5 5.5,34.75 v5.5,39.5 U1.31 | U1.55 8,29.25 8.5,29.75 v13.75,29.75 | 11.12,18.88 10.5,19.5 U4.6 | U4.33 9,23.25 | U4.33 10.5,21.75 | 9,21.75 U4.33 | 8.25,14.12 B1.5 B1.2 11.25,14.12 | U4.3 9,21 8.5,21.5 | U4.9 11.5,20.75 11,21.25 10.75,21.25 | U4.9 13.38,20.75 C11.2 | U4.12 10.5,22.25 v10.5,22.5 | U4.10 U4.9
  Top 0.25: 11,23.75 U4.18 | U4.16 11.5,24.25 11,23.75 | 9.5,25 9.5,23.75 | 8.5,21.25 U4.2 8.5,19 9,19.5 U4.3 9,21.5 | 8.5,21.25 8.75,21.5 | 8.75,21.5 9,21.75 | 8,20.75 U4.1 | 8.5,21.25 8,20.75 | 8,20.75 U4.32 | 8.5,21.25 U4.31 | U4.30 8.5,21.75 8.75,21.5 | 10.5,21.75 10.5,21.5 | 10.5,21.5 U4.6 | U4.7 11,21 10.75,21.25 10.5,21.5 | 9,23.25 U4.27 | v10.5,22.5 10.5,23.25 11,23.75
  Top 0.4: v1.12,26.62 C18.1 | U$62.GND 26,31.25 25.25,31.25 v25.12,31.12 | C15.1 26.25,37.62 | C15.1 26.25,38.62 26,38.88 26,39 | 25.38,38.12 25.62,37.88 C15.1 | JTAG1.5 28.25,40.5 29,39.75 v32.75,39.75 | C29.1 14.5,25.88 v14.5,27
  Top 0.6: R1.2 30.75,30 | C6.2 30.75,30 | 30.75,30 R16.1
  Bottom 0.4: v1.12,20.38 v1.12,26.62
  other vias: 12,14.12 7.5,14.12 39.38,24 12,35.75 16.88,34.88 20.5,28.88 25.12,32.88 16,41 5.5,26.62 2.5,37.38 14.38,38.88 5.25,43.62 34.25,27.5 9,22.5 8.25,29.75 26.88,32.88 26.88,31.12 20.5,27.5 45.88,29.25 34.12,37.5 33.75,32.5 13.75,27 8,5.75 13.12,5.75 30.75,36.5 23.44,20.25
  pour Bottom (isolate 0.4): 0,47 50,47 50,0 0,0
  pour Top (isolate 0.4): 0,47 50,47 50,0 0,0
IRQ
  Top 0.2: U4.24 8,25.5 6.5,27 U1.52
ISP  (via drill 0.3)
  Top 0.2: U1.53 7,29.5 v6.75,29.75 | v2.5,29.75 R19.2
  Bottom 0.2: v2.5,29.75 v6.75,29.75
MDC  (via drill 0.3)
  Top 0.2: U1.87 21.12,35.5 22.12,34.5 v22.94,34.5 | U$62.13 v22.94,33.25
  Bottom 0.2: v22.94,34.5 v22.94,33.25
MDIO
  Top 0.2: U1.86 20.88,35 22,33.88 24.75,33.88 U$62.12 24.75,34.12
N$5
  Top 0.2: U4.14 U4.13 13.5,22.75 C11.1
N$20
  Top 0.2: U$62.2 R16.2
N$21
  Top 0.2: U$62.5 31.75,32.75 32,33 32,34.6 32.25,34.6 Y1.2
  Top 0.4: C2.1 32.25,34.6
N$22
  Top 0.2: U$62.4 31.75,32.25 32,32 32,30.4 32.25,30.4 Y1.1
  Top 0.4: C8.1 32.25,30.4
PWR
  Top 0.4: C24.2 C25.2 44.85,17.62 Q1.3
  Top 0.406: C24.2 40.25,7.5 38.5,5.75 38.5,5 38,4.5 38,4.8 J1.VIN0
PWR_MON  (via drill 0.3)
  Top 0.2: U1.99 21.62,41.5 v22.12,41
  Top 0.4: R8.2 R9.1 v47.25,26.75
  Bottom 0.2: v47.25,26.75 47.25,38.25 45.25,40.25 36.75,40.25 36.25,40.75 24.25,40.75 23.75,41.25 22.38,41.25 v22.12,41
Q1DOWN
  Top 0.4: R7.2 47.52,19.48 Q1.1
RADIORST
  Top 0.2: U4.8 14.3,20.05 17.5,23.25 U1.74
RBIAS
  Top 0.2: U$62.24 27.25,29.75 28,29 29,29 R1.1
RD+
  Top 0.2: U$18.7 26.49,24.01 26.25,24.25 26.25,26 R21.2 25.75,27 U$62.21
RD-
  Top 0.2: U$18.8 25.5,22.53 R22.1 24.75,26 24.75,27.5 25.25,28 U$62.20
RF_/SEL  (via drill 0.3)
  Top 0.2: v8.25,26.25 8.5,26 U4.23 | v12.12,27 12,27.12 U1.63
  Bottom 0.2: v8.25,26.25 8.5,26 10.25,26 11.25,27 v12.12,27
RF_MISO
  Top 0.2: U1.61 11,27 10,26 U4.20
RF_MOSI
  Top 0.2: U4.22 9,26.75 9.5,27.25 10.25,27.25 10.5,27.5 U1.60
RF_SCLK
  Top 0.2: U4.19 10.5,26 11.5,27 U1.62
RF_XTAL1
  Top 0.2: U4.26 6.88,23.75 6.62,23.5 4.75,23.5 4.25,23 4.25,19.62 3.52,18.9 Y2.3
  Top 0.6: C17.2 3.38,18.5 Y2.3
RF_XTAL2
  Top 0.2: U4.25 6.88,24.25 6.5,23.88 C18.2
  Top 0.6: Y2.1 1.1,23.85 C18.2
RFN
  Top 0.2: U4.5 10,19.25 10.75,18.5 C13.1
RFP
  Top 0.2: U4.4 9.5,19.25 8.75,18.5 C14.1
RPWR
  Top 0.4: Q1.2 44.05,21.91 IC1.3 44,21.96 44,23.75 44.38,24.12 C16.2 47.12,24.12 R9.2
SCL
  Top 0.2: R20.2 6.5,45.12 U1.24 6.5,42.88 6.25,42.62 4.22,42.62 IC2.1
SD_CLK  (via drill 0.3)
  Top 0.2: U1.78 18.5,31 18.25,31.25 v17.75,31.25
  Top 0.4: CN2.CLK/SCLK 40.62,30.57 v40.62,42.38
  Bottom 0.2: v17.75,31.25 18.5,32 18.5,41 20.25,42.75 24.5,42.75 25,42.25 36.62,42.25 36.75,42.38 v40.62,42.38
SD_CS  (via drill 0.3)
  Top 0.2: U1.79 18.75,31.5 18.25,32 v17.5,32
  Top 0.4: CN2.DAT3/CS 43.88,30.57 v43.88,43.12
  Bottom 0.2: v17.5,32 18,32.5 18,41.25 20,43.25 24.75,43.25 25.25,42.75 36.5,42.75 36.88,43.12 v43.88,43.12
SD_MISO  (via drill 0.3)
  Top 0.2: U1.77 v18,30.5 | 38.62,30.25 38.62,30.32 CN2.DAT0/DO
  Top 0.4: CN2.DAT0/DO 38.38,30.57 v38.38,41.62
  Bottom 0.2: v18,30.5 19,31.5 19,40.75 20.5,42.25 24.25,42.25 24.75,41.75 36.62,41.75 36.75,41.62 v38.38,41.62
SD_MOSI  (via drill 0.3)
  Top 0.2: U1.76 18.5,30 v18.25,29.75
  Top 0.4: CN2.CMD/DI 42.75,30.6 v42.75,40.88
  Bottom 0.2: v18.25,29.75 19.5,31 19.5,40.5 20.75,41.75 24,41.75 24.5,41.25 36.5,41.25 36.88,40.88 v42.75,40.88
SDA
  Top 0.2: U1.25 6,44.38 5.8,44.58 4.88,44.58 | IC2.3 4.88,44.58 | 4.88,44.58 R18.2
SLP_TR
  Top 0.2: U4.11 15.25,21.75 17,23.5 U1.73
TCK_SWDCLK
  Top 0.2: JTAG1.4 26.98,43.98 26,43 19.25,43 18.25,42 16.75,42 16,42.75 U1.5
TD+
  Top 0.2: U$18.3 30.57,24.07 31,24.5 31,26 30.25,26.75 R17.2 30,27.25 29.25,28 28.25,28 26.75,29.5 U$62.23
TD-
  Top 0.2: U$18.4 29.55,24.8 R6.1 29.25,26 29.25,27.38 29,27.62 27.88,27.62 26.25,29.25 U$62.22
TDI  (via drill 0.3)
  Top 0.2: v30.12,43.38 29.52,43.98 JTAG1.8 | U1.2 17.5,44.75 17.75,45 v18.75,45
  Bottom 0.2: v18.75,45 19,45 19.75,44.25 25.25,44.25 25.75,43.75 28.25,43.75 28.5,44 29.5,44 v30.12,43.38
TDO_SWO  (via drill 0.3)
  Top 0.2: v28.88,43.38 28.25,44 JTAG1.6 | v18.75,44.25 18,44.25 U1.1
  Bottom 0.2: v18.75,44.25 19.25,43.75 25,43.75 25.5,43.25 28.75,43.25 v28.88,43.38
TMS_SWDIO
  Top 0.2: U1.3 17,42.75 17.25,42.5 18,42.5 19,43.5 25.25,43.5 25.71,43.96 JTAG1.2
UNBAL
  Top 0.2: B1.1 10.55,12.75 10.54,12.75
  Top 1.71: J$1.SIG 10.54,12.75
VDDCR
  Top 0.2: U$62.6 28.5,33.25 C21.1
  Top 0.4: C20.1 C21.1
XTAL1  (via drill 0.3)
  Top 0.2: C1.2 v1.12,41.62 | v7.5,42.25 U1.22
  Top 0.6: C3.1 C1.2
  Bottom 0.2: v7.5,42.25 6.88,41.62 v1.12,41.62
YLED  (via drill 0.3)
  Top 0.2: U1.70 v15.5,27 | U$18.2 31.77,21.02 29.38,18.62 21.5,18.62 19.12,21 v19.12,22.25
  Bottom 0.2: v19.12,22.25 15.5,25.88 v15.5,27
YLED+
  Top 0.4: R15.1 33.61,25.25 U$18.1
(copper drawn outside any net)
  shapes: Top circle x3

### Text on the board
Top: JTAG | µSD Card | LPC1766 | 868MHz | RP/SMA
Bottom: Richard Meadows 2013 | Ethernet | DC Power | 10BASE-T / 100BASE-TX | 4.5V - 20V
tStop: JTAG | µSD Card | 868MHz | RP/SMA
bStop: Richard Meadows 2013 | Ethernet | DC Power | 10BASE-T / 100BASE-TX | 4.5V - 20V